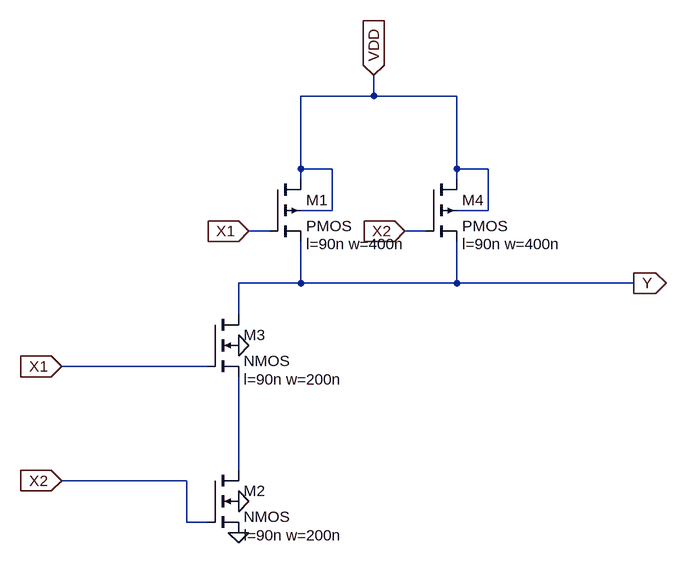
[diagram p0: schematic nand.asc]
nand.asc, the LTspice schematic file:
Version 4
SHEET 1 1104 1140
WIRE 272 -16 272 -48
WIRE 272 -16 160 -16
WIRE 400 -16 272 -16
WIRE 160 96 160 -16
WIRE 208 96 160 96
WIRE 400 96 400 -16
WIRE 448 96 400 96
WIRE 160 112 160 96
WIRE 400 112 400 96
WIRE 208 160 208 96
WIRE 208 160 160 160
WIRE 448 160 448 96
WIRE 448 160 400 160
WIRE 112 192 80 192
WIRE 352 192 320 192
WIRE 160 272 160 208
WIRE 160 272 64 272
WIRE 400 272 400 208
WIRE 400 272 160 272
WIRE 672 272 400 272
WIRE 64 320 64 272
WIRE 16 400 -208 400
WIRE 64 560 64 416
WIRE -16 576 -208 576
WIRE -16 640 -16 576
WIRE 16 640 -16 640
FLAG -208 400 X1
IOPIN -208 400 In
FLAG -208 576 X2
IOPIN -208 576 In
FLAG 64 656 0
FLAG 64 608 0
FLAG 272 -48 VDD
IOPIN 272 -48 In
FLAG 80 192 X1
IOPIN 80 192 In
FLAG 320 192 X2
IOPIN 320 192 In
FLAG 672 272 Y
IOPIN 672 272 Out
FLAG 64 368 0
SYMBOL pmos4 112 112 R0
WINDOW 123 56 100 Left 2
SYMATTR Value2 l=90n w=400n
SYMATTR InstName M1
SYMBOL nmos4 16 560 R0
WINDOW 123 56 100 Left 2
SYMATTR Value2 l=90n w=200n
SYMATTR InstName M2
SYMBOL nmos4 16 320 R0
WINDOW 123 56 100 Left 2
SYMATTR Value2 l=90n w=200n
SYMATTR InstName M3
SYMBOL pmos4 352 112 R0
WINDOW 123 56 100 Left 2
SYMATTR Value2 l=90n w=400n
SYMATTR InstName M4

The netlist it stands for:
* nand.asc
M1 VDD X1 Y VDD PMOS l=90n w=400n
M2 N001 X2 0 0 NMOS l=90n w=200n
M3 Y X1 N001 0 NMOS l=90n w=200n
M4 VDD X2 Y VDD PMOS l=90n w=400n
.model NMOS NMOS
.model PMOS PMOS
.lib standard.mos
.backanno
.end